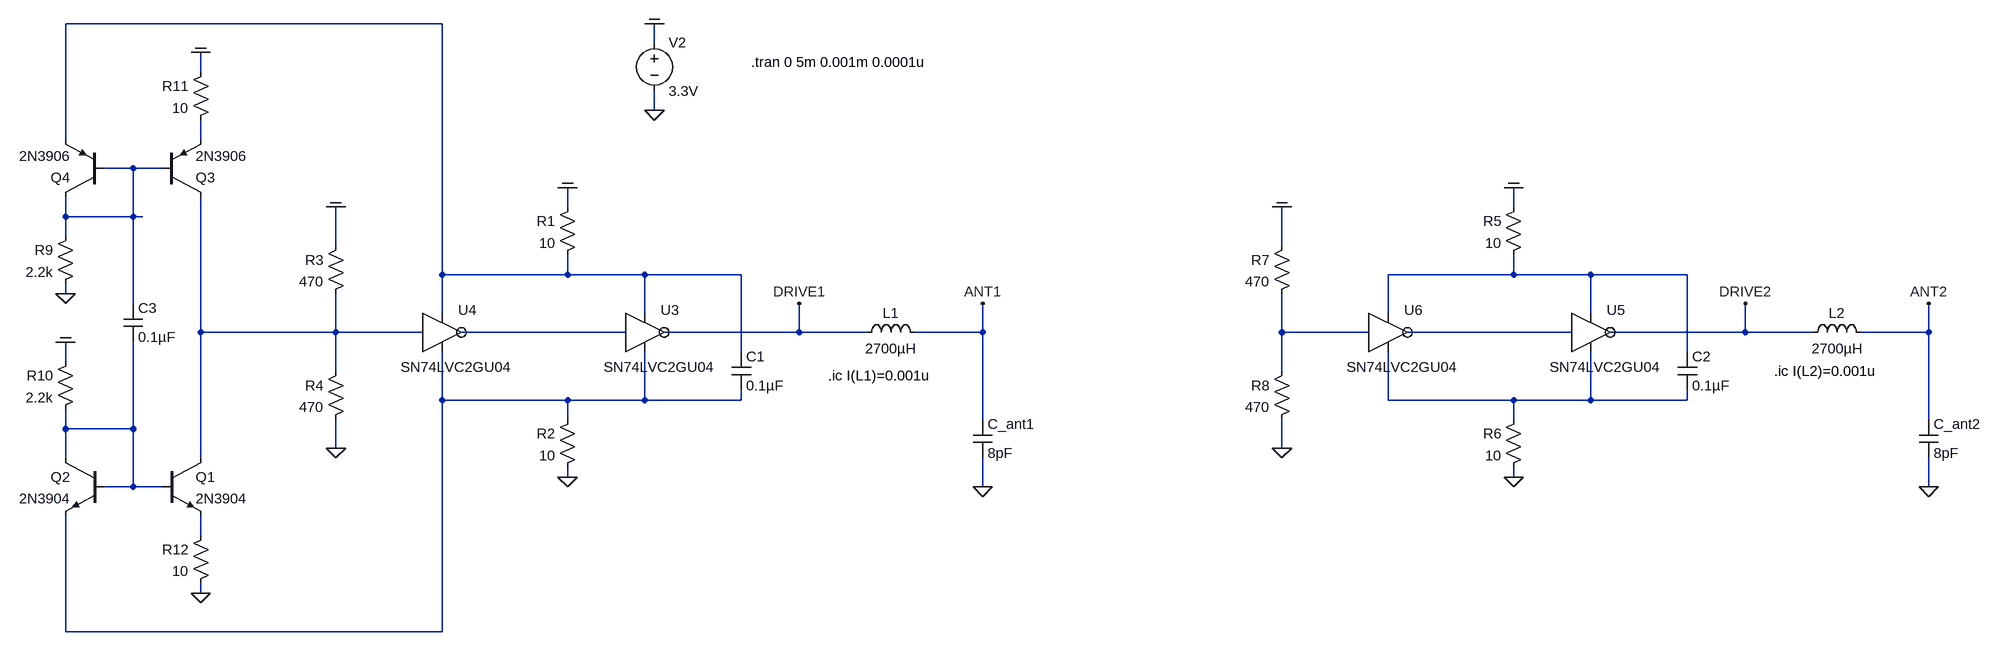
[diagram p0: schematic 2021_current_sensing_unbuffered_inverter_01.asc]
2021_current_sensing_unbuffered_inverter_01.asc, the LTspice schematic file:
Version 4
SHEET 1 9876 8692
WIRE 2992 2048 2368 2048
WIRE 3344 2080 3344 2048
WIRE 2592 2128 2592 2096
WIRE 3344 2192 3344 2160
WIRE 2368 2240 2368 2048
WIRE 2592 2240 2592 2208
WIRE 2480 2288 2432 2288
WIRE 2528 2288 2480 2288
WIRE 3200 2352 3200 2320
WIRE 4768 2352 4768 2320
WIRE 2368 2368 2368 2336
WIRE 2480 2368 2480 2288
WIRE 2480 2368 2368 2368
WIRE 2496 2368 2480 2368
WIRE 2368 2400 2368 2368
WIRE 2816 2416 2816 2352
WIRE 4384 2416 4384 2352
WIRE 2992 2464 2992 2048
WIRE 3200 2464 3200 2432
WIRE 3200 2464 2992 2464
WIRE 3328 2464 3200 2464
WIRE 3488 2464 3328 2464
WIRE 4768 2464 4768 2432
WIRE 4768 2464 4560 2464
WIRE 4896 2464 4768 2464
WIRE 5056 2464 4896 2464
WIRE 2368 2496 2368 2480
WIRE 2480 2512 2480 2368
WIRE 2992 2528 2992 2464
WIRE 3328 2528 3328 2464
WIRE 4560 2528 4560 2464
WIRE 4896 2528 4896 2464
WIRE 2592 2560 2592 2336
WIRE 2816 2560 2816 2496
WIRE 2816 2560 2592 2560
WIRE 2960 2560 2816 2560
WIRE 3296 2560 3024 2560
WIRE 3584 2560 3584 2512
WIRE 3584 2560 3360 2560
WIRE 3696 2560 3584 2560
WIRE 3888 2560 3888 2512
WIRE 3888 2560 3776 2560
WIRE 4384 2560 4384 2496
WIRE 4528 2560 4384 2560
WIRE 4864 2560 4592 2560
WIRE 5152 2560 5152 2512
WIRE 5152 2560 4928 2560
WIRE 5264 2560 5152 2560
WIRE 5456 2560 5456 2512
WIRE 5456 2560 5344 2560
WIRE 3488 2592 3488 2464
WIRE 5056 2592 5056 2464
WIRE 2368 2608 2368 2576
WIRE 2816 2624 2816 2560
WIRE 4384 2624 4384 2560
WIRE 2992 2672 2992 2592
WIRE 3200 2672 2992 2672
WIRE 3328 2672 3328 2592
WIRE 3328 2672 3200 2672
WIRE 3488 2672 3488 2656
WIRE 3488 2672 3328 2672
WIRE 4560 2672 4560 2592
WIRE 4768 2672 4560 2672
WIRE 4896 2672 4896 2592
WIRE 4896 2672 4768 2672
WIRE 5056 2672 5056 2656
WIRE 5056 2672 4896 2672
WIRE 3200 2704 3200 2672
WIRE 3888 2704 3888 2560
WIRE 4768 2704 4768 2672
WIRE 5456 2704 5456 2560
WIRE 2368 2720 2368 2688
WIRE 2480 2720 2480 2576
WIRE 2480 2720 2368 2720
WIRE 2816 2752 2816 2704
WIRE 4384 2752 4384 2704
WIRE 2368 2768 2368 2720
WIRE 2592 2768 2592 2560
WIRE 3200 2800 3200 2784
WIRE 4768 2800 4768 2784
WIRE 2480 2816 2480 2720
WIRE 2480 2816 2432 2816
WIRE 2528 2816 2480 2816
WIRE 3888 2816 3888 2768
WIRE 5456 2816 5456 2768
WIRE 2592 2896 2592 2864
WIRE 2592 2992 2592 2976
WIRE 2368 3056 2368 2864
WIRE 2992 3056 2992 2672
WIRE 2992 3056 2368 3056
FLAG 3344 2192 0
FLAG 3344 2048 COM
FLAG 2368 2576 COM
FLAG 2368 2496 0
FLAG 2592 2992 0
FLAG 2592 2096 COM
FLAG 2816 2352 COM
FLAG 2816 2752 0
FLAG 3200 2800 0
FLAG 3200 2320 COM
FLAG 3888 2816 0
FLAG 4384 2352 COM
FLAG 4384 2752 0
FLAG 4768 2800 0
FLAG 4768 2320 COM
FLAG 5456 2816 0
FLAG 3888 2512 ANT1
FLAG 5456 2512 ANT2
FLAG 5152 2512 DRIVE2
FLAG 3584 2512 DRIVE1
SYMBOL voltage 3344 2064 R0
WINDOW 123 0 0 Left 2
WINDOW 39 0 0 Left 2
SYMATTR InstName V2
SYMATTR Value 3.3V
SYMBOL npn 2528 2768 R0
SYMATTR InstName Q1
SYMATTR Value 2N3904
SYMBOL npn 2432 2768 M0
SYMATTR InstName Q2
SYMATTR Value 2N3904
SYMBOL pnp 2528 2336 M180
SYMATTR InstName Q3
SYMATTR Value 2N3906
SYMBOL pnp 2432 2336 R180
SYMATTR InstName Q4
SYMATTR Value 2N3906
SYMBOL res 2384 2384 M0
WINDOW 0 36 40 Left 2
WINDOW 3 36 76 Left 2
SYMATTR InstName R9
SYMATTR Value 2.2k
SYMBOL res 2384 2592 M0
WINDOW 0 36 40 Left 2
WINDOW 3 36 76 Left 2
SYMATTR InstName R10
SYMATTR Value 2.2k
SYMBOL res 2608 2880 M0
WINDOW 0 36 40 Left 2
WINDOW 3 36 76 Left 2
SYMATTR InstName R12
SYMATTR Value 10
SYMBOL res 2608 2112 M0
WINDOW 0 36 40 Left 2
WINDOW 3 36 76 Left 2
SYMATTR InstName R11
SYMATTR Value 10
SYMBOL res 2832 2400 M0
WINDOW 0 36 40 Left 2
WINDOW 3 36 76 Left 2
SYMATTR InstName R3
SYMATTR Value 470
SYMBOL res 2832 2608 M0
WINDOW 0 36 40 Left 2
WINDOW 3 36 76 Left 2
SYMATTR InstName R4
SYMATTR Value 470
SYMBOL res 3216 2688 M0
WINDOW 0 36 40 Left 2
WINDOW 3 36 76 Left 2
SYMATTR InstName R2
SYMATTR Value 10
SYMBOL res 3216 2336 M0
WINDOW 0 36 40 Left 2
WINDOW 3 36 76 Left 2
SYMATTR InstName R1
SYMATTR Value 10
SYMBOL cap 3472 2592 R0
SYMATTR InstName C1
SYMATTR Value 0.1µF
SYMBOL ind 3680 2576 R270
WINDOW 0 32 56 VTop 2
WINDOW 3 5 56 VBottom 2
SYMATTR InstName L1
SYMATTR Value 2700µH
SYMATTR SpiceLine Rser=120 Cpar=1.2pF
SYMBOL cap 3872 2704 R0
SYMATTR InstName C_ant1
SYMATTR Value 8pF
SYMBOL SN74LVC2GU04 3328 2560 R0
SYMATTR InstName U3
SYMBOL SN74LVC2GU04 2992 2560 R0
SYMATTR InstName U4
SYMBOL cap 2464 2512 R0
SYMATTR InstName C3
SYMATTR Value 0.1µF
SYMBOL res 4400 2400 M0
WINDOW 0 36 40 Left 2
WINDOW 3 36 76 Left 2
SYMATTR InstName R7
SYMATTR Value 470
SYMBOL res 4400 2608 M0
WINDOW 0 36 40 Left 2
WINDOW 3 36 76 Left 2
SYMATTR InstName R8
SYMATTR Value 470
SYMBOL res 4784 2688 M0
WINDOW 0 36 40 Left 2
WINDOW 3 36 76 Left 2
SYMATTR InstName R6
SYMATTR Value 10
SYMBOL res 4784 2336 M0
WINDOW 0 36 40 Left 2
WINDOW 3 36 76 Left 2
SYMATTR InstName R5
SYMATTR Value 10
SYMBOL cap 5040 2592 R0
SYMATTR InstName C2
SYMATTR Value 0.1µF
SYMBOL ind 5248 2576 R270
WINDOW 0 32 56 VTop 2
WINDOW 3 5 56 VBottom 2
SYMATTR InstName L2
SYMATTR Value 2700µH
SYMATTR SpiceLine Rser=120 Cpar=1.2pF
SYMBOL cap 5440 2704 R0
SYMATTR InstName C_ant2
SYMATTR Value 8pF
SYMBOL SN74LVC2GU04 4896 2560 R0
SYMATTR InstName U5
SYMBOL SN74LVC2GU04 4560 2560 R0
SYMATTR InstName U6
TEXT 3504 2112 Left 2 !.tran 0 5m 0.001m 0.0001u
TEXT 3632 2632 Left 2 !.ic I(L1)=0.001u
TEXT 5200 2624 Left 2 !.ic I(L2)=0.001u

The netlist it stands for:
* 2021_current_sensing_unbuffered_inverter_01.asc
V2 COM 0 3.3V
Q1 N005 N011 N012 0 2N3904
Q2 N011 N011 N009 0 2N3904
Q3 N005 N003 N002 0 2N3906
Q4 N003 N003 N001 0 2N3906
R9 N003 0 2.2k
R10 COM N011 2.2k
R12 N012 0 10
R11 COM N002 10
R3 COM N005 470
R4 N005 0 470
R2 N009 0 10
R1 COM N001 10
C1 N001 N009 0.1µF
L1 DRIVE1 ANT1 2700µH Rser=120 Cpar=1.2pF
C_ant1 ANT1 0 8pF
XU3 DRIVE1 N006 N001 N009 SN74LVC2GU04  ; pins Y A VCC AGND
XU4 N006 N005 N001 N009 SN74LVC2GU04  ; pins Y A VCC AGND
C3 N003 N011 0.1µF
R7 COM N007 470
R8 N007 0 470
R6 N010 0 10
R5 COM N004 10
C2 N004 N010 0.1µF
L2 DRIVE2 ANT2 2700µH Rser=120 Cpar=1.2pF
C_ant2 ANT2 0 8pF
XU5 DRIVE2 N008 N004 N010 SN74LVC2GU04  ; pins Y A VCC AGND
XU6 N008 N007 N004 N010 SN74LVC2GU04  ; pins Y A VCC AGND
.model NPN NPN
.model PNP PNP
.lib standard.bjt
.tran 0 5m 0.001m 0.0001u
.ic I(L1)=0.001u
.ic I(L2)=0.001u
.lib SN74LVC2GU04.cir
.backanno
.end